# Altium project PCB_Project.PrjPcb (part 3 of 4)
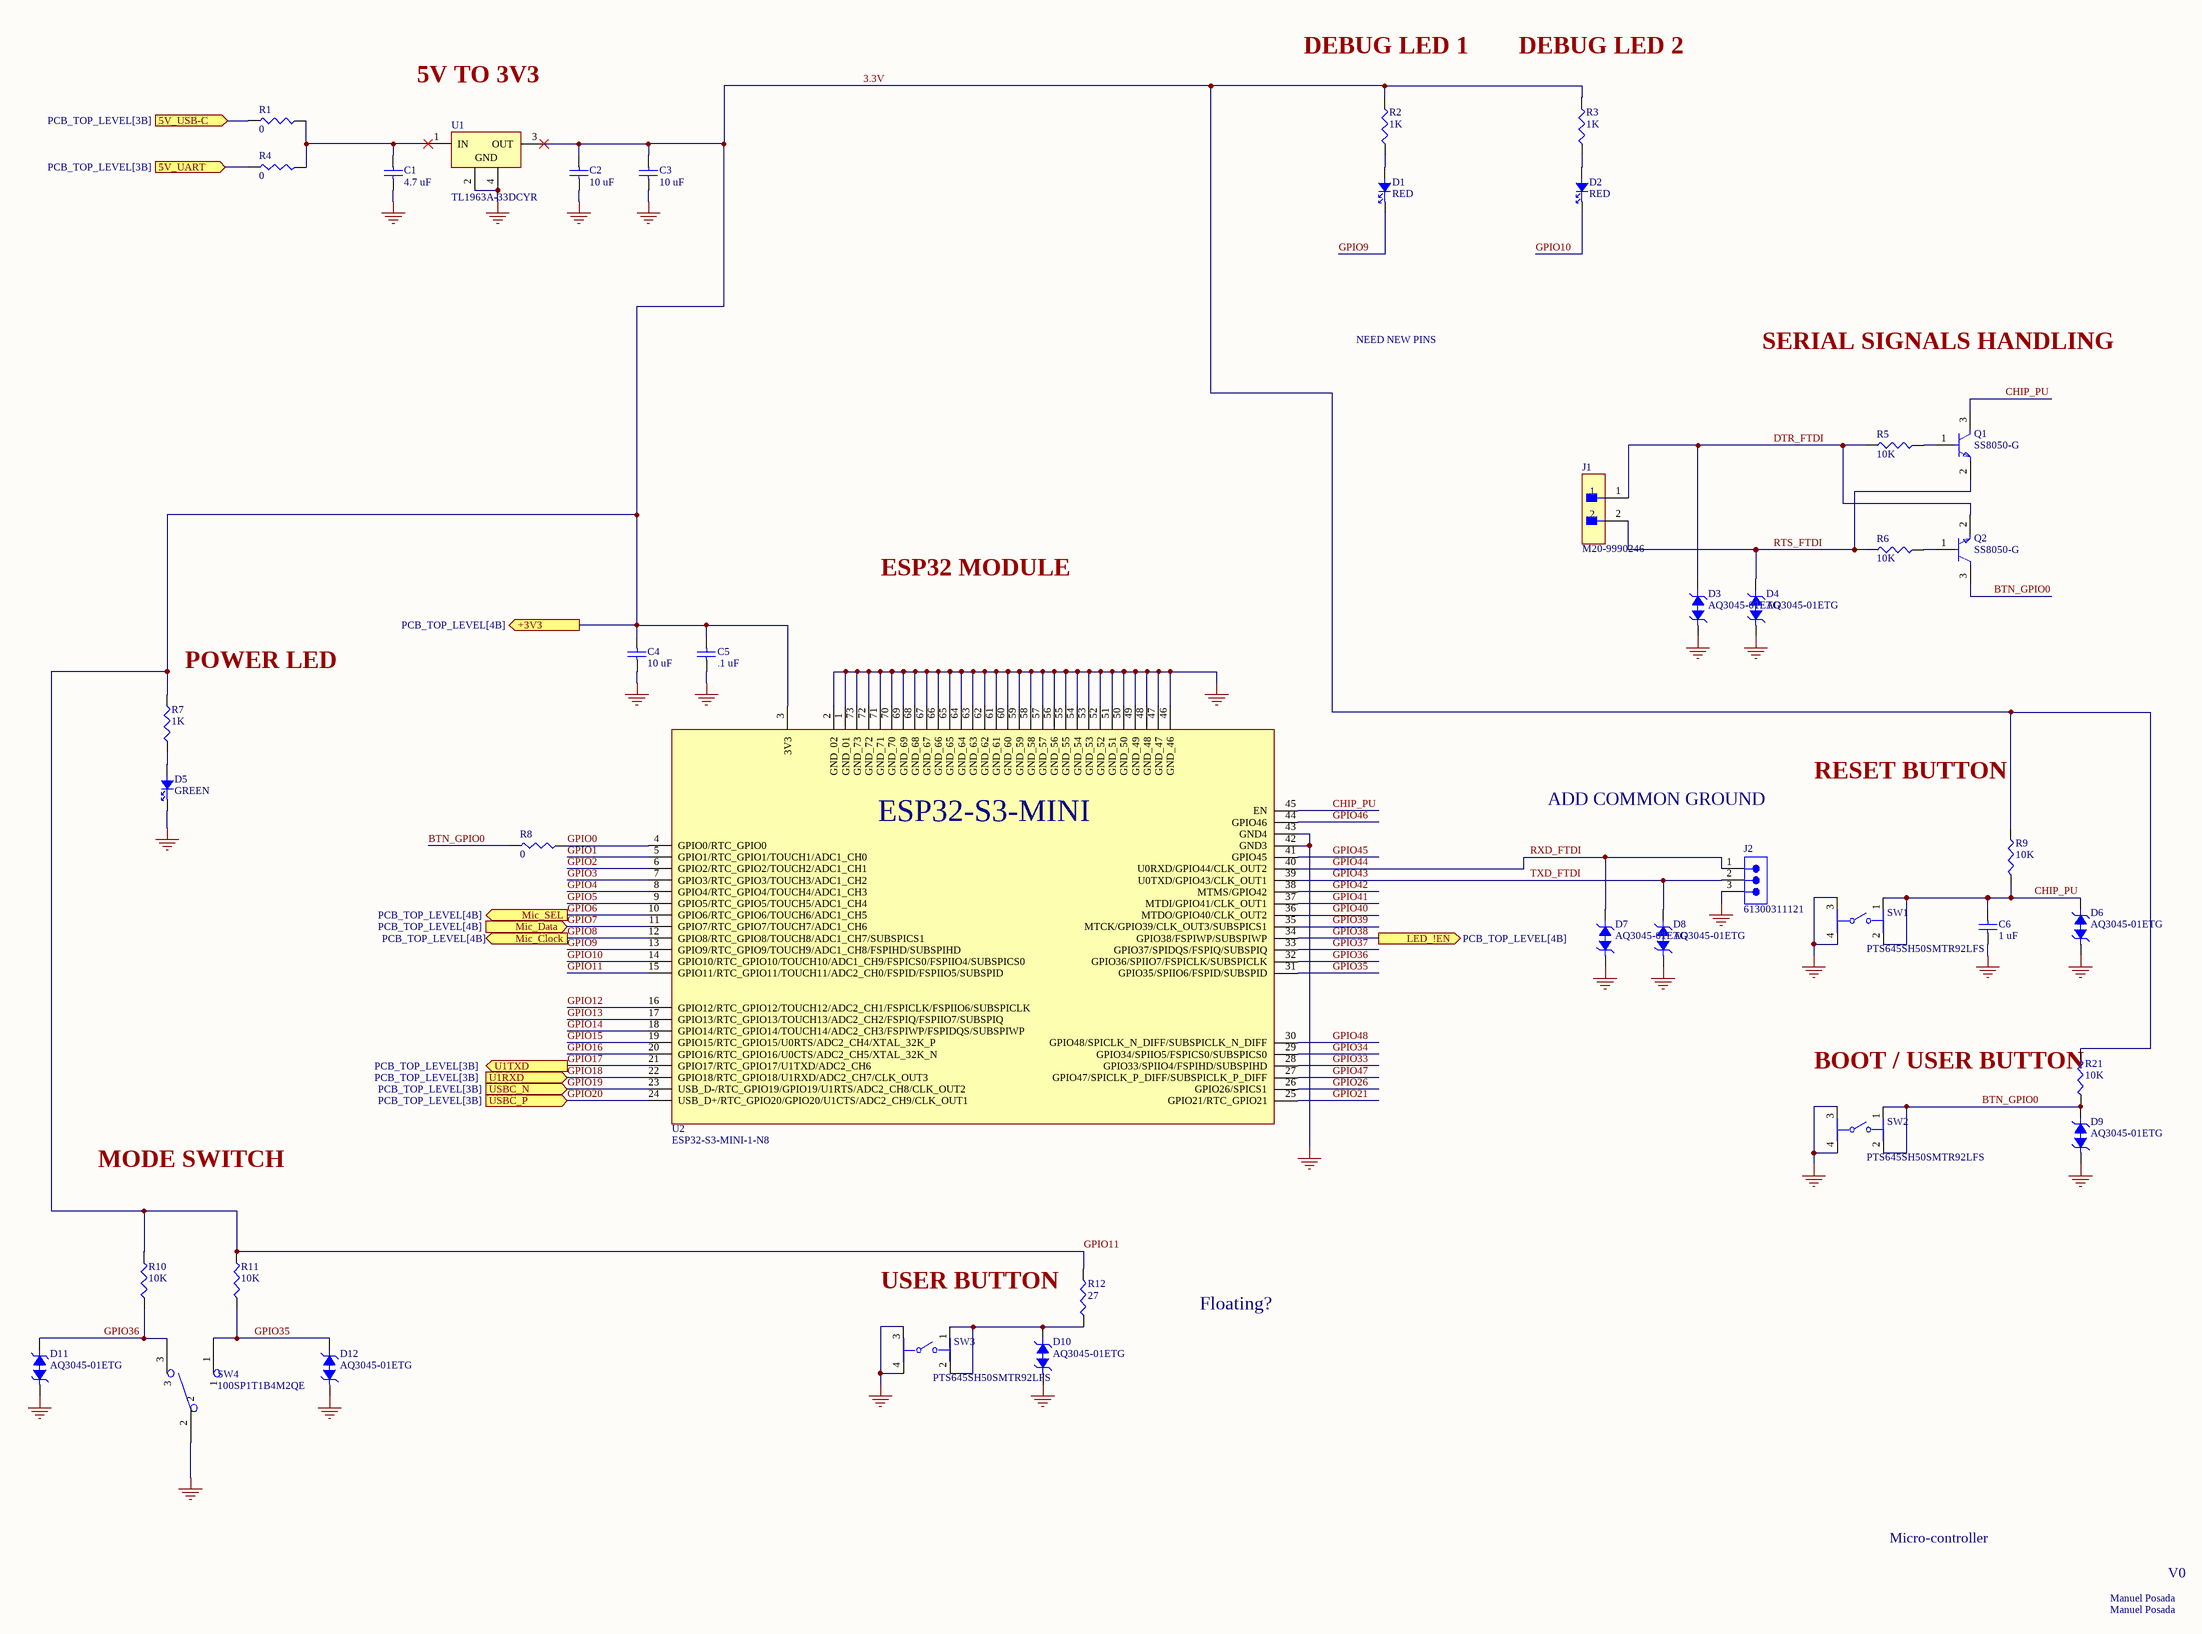
[diagram p7: Micro_controller.SchDoc]

## Sheet Micro_controller.SchDoc (continued)

### Library data of the parts (continued)
SW4 = 100SP1T1B4M2QE: Switch Toggle ON None ON SPDT Round Lever PC Pins 5A 250VAC 28VDC PC Mount; Manufacturer: E-Switch; Actuator Length: 10.414mm; Actuator Material: Brass, Chrome; Contact Voltage Rating (AC): 120V; Electrical Life: 50kcycles; Illumination Type: Illuminated, Non-Illuminated; Max Voltage Rating (DC): 28V; Number of Positions: 2; Sealable: EPOXY TERMINAL SEALED; Switch Function: On-On; Supplier: DigiKey; Supplier Part Number: EG2355-ND; Manufacturer Part Number: 100SP1T1B4M2QE; RoHS: Compliant; Category: Toggle Switches; Stock: 13324; Pricing: 1=2.63, 10=2.272, 25=2.1428, 50=2.05, 108=1.9513, 324=1.81836, 540=1.75957, 1080=1.68271 (USD); Contact Current Rating: 5A; Contact Plating: Silver; Country of Origin: Mainland China; Current Rating: 5A; Export Control Classification Number (ECCN) Code: EAR99; Height: 8.89mm; Harmonized Tariff Schedule (HTS) Code: 8536.50.70.00; Introduction Date: 2011-01-05; Lead Free: Lead Free; Length: 12.7mm; Lifecycle Status: Production; Max Current Rating: 5A; Max Operating Temperature: 85°C; Min Operating Temperature: -30°C; Mounting Technology: Through Hole; Orientation: Vertical; REACH SVHC: Yes; Termination: PC Pin; Throw Configuration: SPDT; Voltage Rating (AC): 120V; Voltage Rating (DC): 28V; ComponentLink1URL: https://datasheet.octopart.com:443/100SP1T1B4M2QE-E-Switch-datasheet-17722722.pdf?src-supplier=IHS; ComponentLink1Description: https://datasheet.octopart.com:443/100SP1T1B4M2QE-E-Switch-datasheet-17722722.pdf?src-supplier=IHS; ComponentLink2URL: https://datasheet.octopart.com:443/100SP1T1B4M2QE-E-Switch-datasheet-112052116.pdf?src-supplier=Farnell; ComponentLink2Description: https://datasheet.octopart.com:443/100SP1T1B4M2QE-E-Switch-datasheet-112052116.pdf?src-supplier=Farnell; ComponentLink3URL: https://datasheet.octopart.com:443/100SP1T1B4M2QE-E-Switch-datasheet-178529814.pdf?src-supplier=Future+Electronics; ComponentLink3Description: https://datasheet.octopart.com:443/100SP1T1B4M2QE-E-Switch-datasheet-178529814.pdf?src-supplier=Future+Electronics; ComponentLink4URL: https://datasheet.octopart.com:443/100SP1T1B4M2QE-E-Switch-datasheet-41351065.pdf?src-supplier=element14+APAC; ComponentLink4Description: https://datasheet.octopart.com:443/100SP1T1B4M2QE-E-Switch-datasheet-41351065.pdf?src-supplier=element14+APAC; ComponentLink5URL: https://datasheet.octopart.com:443/100SP1T1B4M2QE-E-Switch-datasheet-501321.pdf?src-supplier=Newark; ComponentLink5Description: https://datasheet.octopart.com:443/100SP1T1B4M2QE-E-Switch-datasheet-501321.pdf?src-supplier=Newark
U1 = TL1963A-33DCYR: IC REG LINEAR 3.3V 1.5A SOT223-4; Manufacturer: Texas Instruments; Package Body Material: Plastic; Adjustability: FIXED; Dropout Voltage1-Max: 550mV; Dropout Voltage1-Nom: 340mV; Input Voltage Absolute-Max: 20V; Min Input Voltage: 3.8V; Line Regulation-Max: 0.01%; Load Regulation-Max: 0.07%; Channels: 1; Output Voltage1-Max: 3.4V; Output Voltage1-Min: 3.2V; Regulator Type: FIXED POSITIVE SINGLE OUTPUT LDO REGULATOR; Voltage Tolerance-Max: 3%; Qualification Status: Not Qualified; Supplier: Digikey; Supplier Part Number: 296-24897-1-ND; Manufacturer Part Number: TL1963A-33DCYR; RoHS: Yes; Category: Voltage Regulators - Linear; Stock: 4105; Pricing: 1=2.91, 10=2.614, 25=2.4712, 100=2.1417, 250=2.03188, 500=1.8232, 1000=1.53764 (USD); Case/Package: SOP; Pins: 4; Package Shape: Rectangular; Terminal Finish: Tin; JESD-609 Code: e3; Max Supply Voltage: 20V; JESD-30 Code: R-PDSO-G4; Moisture Sensitivity Level: 2; Number of Outputs: 1; Operating Temperature, TJ-Max: 125°C; Operating Temperature, TJ-Min: -40°C; Output Current1-Max: 1.5A; Output Voltage1-Nom: 3.3V; Package Style: SMALL OUTLINEMeter; Packaging: Tape and Reel; Peak Reflow Temperature (Cel): 260°C; Surface Mount: Yes; Technology: BIPOLAR; Terminal Form: Gull Wing; Terminal Position: DUAL; Length: 6.5mm; Width: 3.5mm; Height - Seated (Max): 1.8mm; Terminal Pitch: 2.3mm; Reach SVHC Compliant: Yes; RoHS Compliant: Yes; ComponentLink1URL: https://www.ti.com:443/lit/ds/symlink/tl1963a.pdf?src-supplier=IHS+Markit; ComponentLink1Description: https://www.ti.com:443/lit/ds/symlink/tl1963a.pdf?src-supplier=IHS+Markit; ComponentLink2URL: https://datasheet.ciiva.com/2046/-2046068.pdf?src-supplier=Digikey; ComponentLink2Description: https://datasheet.ciiva.com/2046/-2046068.pdf?src-supplier=Digikey; LCSC Part Number: C181262
U2 = ESP32-S3-MINI-1-N8: SMD Module, ESP32-S3FN8, 8 mb Sp; Manufacturer: Espressif Systems; Supplier: Digikey; Supplier Part Number: 1965-ESP32-S3-MINI-1-N8CT-ND; Manufacturer Part Number: ESP32-S3-MINI-1-N8; RoHS: No; Category: LDO; Stock: 2024; Pricing: 1=3.1 (USD); LCSC Part Number: C2913206

## Sheet USB-C_to_ESP.SchDoc
size B; SheetNumber: 2; SheetTotal: 6
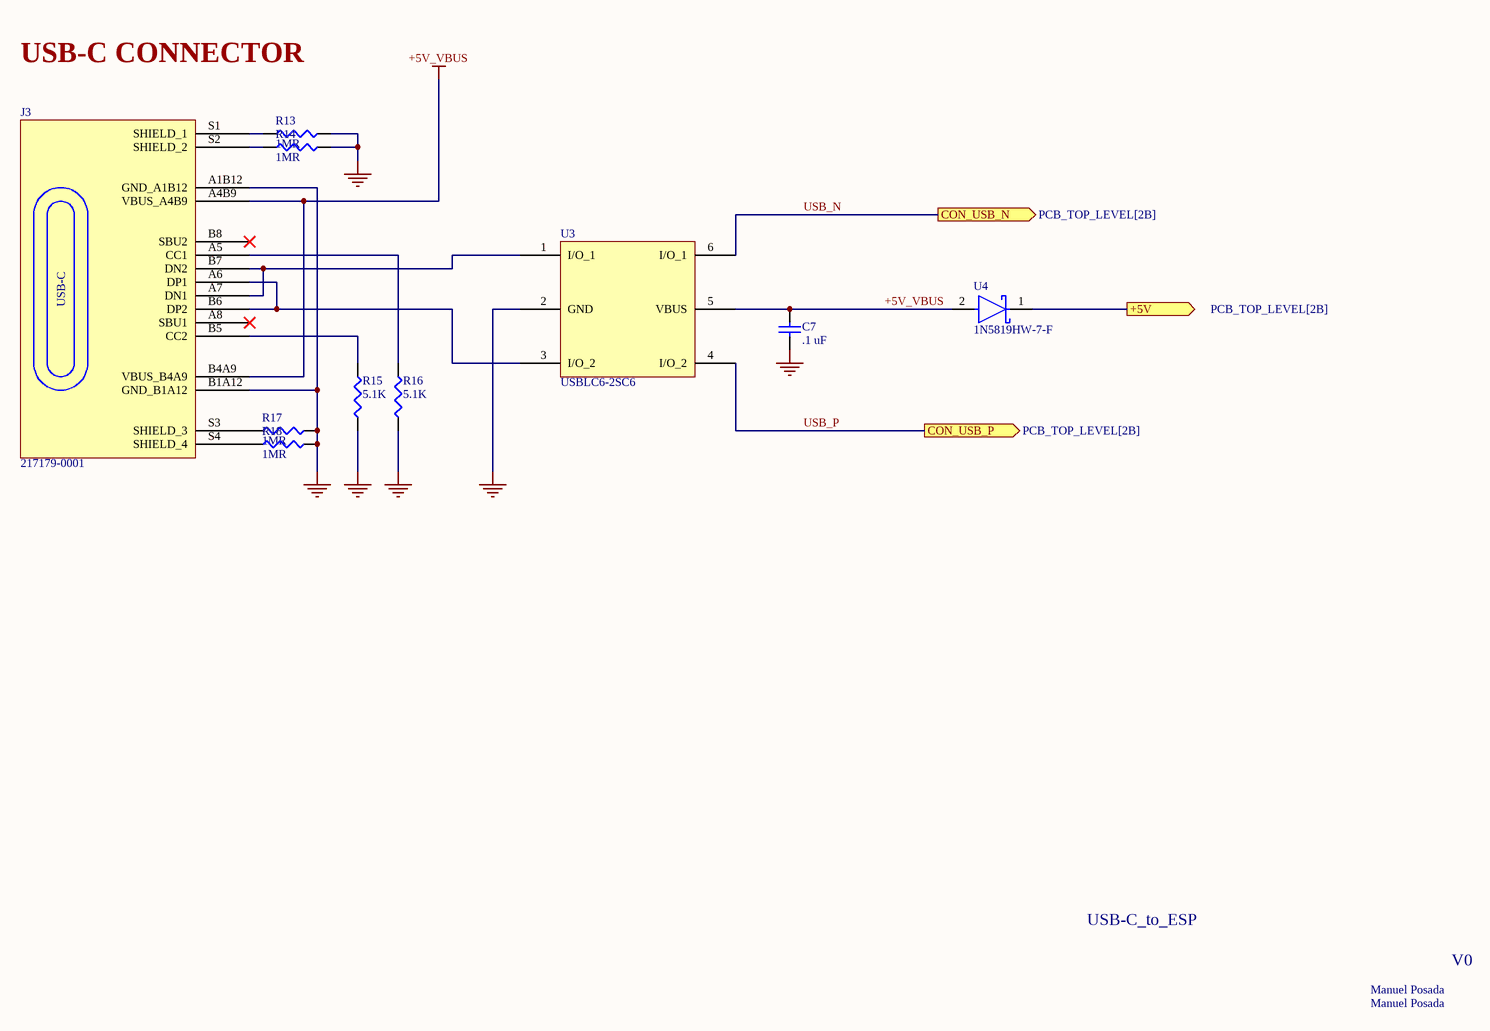
[diagram p2: USB-C_to_ESP.SchDoc]

### Parts
C7  .1 uF  [CAP_CL21_SAM-L]
J3  217179-0001  [FP-2171790001-MFG]
R13  1MR  [RES_1220_SUS-L]
R14  1MR  [RES_1220_SUS-L]
R15  5.1K  [RES_1220_SUS-L]
R16  5.1K  [RES_1220_SUS-L]
R17  1MR  [RES_1220_SUS-L]
R18  1MR  [RES_1220_SUS-L]
U3  USBLC6-2SC6  [SOT23-6L_STM]
U4  1N5819HW-7-F  [FP-SOD123-IPC_B]

### Ports
+5V (out, see PCB_TOP_LEVEL[2B]), CON_USB_N (out, see PCB_TOP_LEVEL[2B]), CON_USB_P (out, see PCB_TOP_LEVEL[2B])

### Nets
+5V_VBUS: C7.2 J3.A4B9(VBUS_A4B9) J3.B4A9(VBUS_B4A9) U3.5(VBUS) U4.2(A)
GND: C7.1 J3.A1B12(GND_A1B12) J3.B1A12(GND_B1A12) R13.2 R14.2 R15.1 R16.1 R17.2 R18.2 U3.2(GND)
USB_N: U3.6(I/O_1) ; port CON_USB_N  [project net GPIO19]
USB_P: U3.4(I/O_2) ; port CON_USB_P  [project net GPIO20]
NetJ3_A5: J3.A5(CC1) R16.2
NetJ3_A6: J3.A6(DP1) J3.B6(DP2) U3.3(I/O_2)
NetJ3_A7: J3.A7(DN1) J3.B7(DN2) U3.1(I/O_1)
NetJ3_B5: J3.B5(CC2) R15.2
NetJ3_S1: J3.S1(SHIELD_1) R13.1
NetJ3_S2: J3.S2(SHIELD_2) R14.1
NetJ3_S3: J3.S3(SHIELD_3) R17.1
NetJ3_S4: J3.S4(SHIELD_4) R18.1
NetR1_1: U4.1(C) ; port +5V

Not connected (* = marked no-connect by the designer): J3 A8(SBU1)* B8(SBU2)*

### Notes on the sheet
- USB-C CONNECTOR
- USB-C_to_ESP
- Manuel Posada
- V0
- (in symbol 217179-0001) USB-C

### Library data of the parts
C7 = CL21B104KBCNNNC: 50V 100nF X7R ±10% 0805 Multilayer Ceramic Capacitors MLCC - SMD/SMT ROHS; Manufacturer: Samsung Electro-Mechanics; Supplier: DigiKey; Supplier Part Number: 1276-1003-6-ND; Manufacturer Part Number: CL21B104KBCNNNC; RoHS: Compliant; Category: Ceramic Capacitors; Stock: 2859375; Pricing: 1=0.08, 10=0.006 (USD); Value: 100nF; Case/Package: 0805; Case Code (Imperial): 0805; Case Code (Metric): 2012; China RoHS: Compliant; Contact Plating: Tin; Country of Origin: Mainland China, Philippines, South Korea; Depth: 1.25mm; Dielectric: X7R; Dielectric Material: Ceramic; Export Control Classification Number (ECCN) Code: EAR99; Height: 950µm; Harmonized Tariff Schedule (HTS) Code: 8532.24.00.20; Introduction Date: 2009-07-27; Lead Free: Lead Free; Length: 2mm; Lifecycle Status: Production; Material: Ceramic; Max Operating Temperature: 125°C; Min Operating Temperature: -55°C; Mounting Technology: Surface Mount; Number of Terminals: 2; Radiation Hardening: No; REACH SVHC: Yes; Schedule B: 8532240020, 8532240020|8532240020, 8532240020|8532240020|8532240020, 8532240020|8532240020|8532240020|8532240020; Thickness: 939.8µm; Tolerance: 10%; Voltage: 50V; Voltage Rating: 50V; Voltage Rating (DC): 50V; Width: 1.25mm; ComponentLink1URL: https://datasheet.octopart.com:443/CL21B104KBCNNNC-Samsung-Electro-Mechanics-datasheet-137745078.pdf?src-supplier=IHS; ComponentLink1Description: https://datasheet.octopart.com:443/CL21B104KBCNNNC-Samsung-Electro-Mechanics-datasheet-137745078.pdf?src-supplier=IHS; ComponentLink2URL: https://datasheet.octopart.com/CL21B104KBCNNNC-Samsung-Electro-Mechanics-datasheet-8324245.pdf; ComponentLink2Description: https://datasheet.octopart.com/CL21B104KBCNNNC-Samsung-Electro-Mechanics-datasheet-8324245.pdf; ComponentLink3URL: https://datasheet.octopart.com/CL21B104KBCNNNC-Samsung-Electro-Mechanics-datasheet-97040617.pdf; ComponentLink3Description: https://datasheet.octopart.com/CL21B104KBCNNNC-Samsung-Electro-Mechanics-datasheet-97040617.pdf; ComponentLink4URL: https://datasheet.octopart.com:443/CL21B104KBCNNNC-Samsung-Electro-Mechanics-datasheet-11548950.pdf?src-supplier=Future+Electronics; ComponentLink4Description: https://datasheet.octopart.com:443/CL21B104KBCNNNC-Samsung-Electro-Mechanics-datasheet-11548950.pdf?src-supplier=Future+Electronics; ComponentLink5URL: https://datasheet.octopart.com:443/CL21B104KBCNNNC-Samsung-Electro-Mechanics-datasheet-116891032.pdf?src-supplier=Future+Electronics; ComponentLink5Description: https://datasheet.octopart.com:443/CL21B104KBCNNNC-Samsung-Electro-Mechanics-datasheet-116891032.pdf?src-supplier=Future+Electronics; ComponentLink6URL: https://datasheet.octopart.com:443/CL21B104KBCNNNC-Samsung-Electro-Mechanics-datasheet-81462175.pdf?src-supplier=Future+Electronics; ComponentLink6Description: https://datasheet.octopart.com:443/CL21B104KBCNNNC-Samsung-Electro-Mechanics-datasheet-81462175.pdf?src-supplier=Future+Electronics; ComponentLink7URL: https://datasheet.octopart.com:443/CL21B104KBCNNNC-Samsung-datasheet-42485244.pdf?src-supplier=Future+Electronics; ComponentLink7Description: https://datasheet.octopart.com:443/CL21B104KBCNNNC-Samsung-datasheet-42485244.pdf?src-supplier=Future+Electronics; ComponentLink8URL: https://datasheet.octopart.com:443/CL21B104KBCNNNC-Samsung-Electro-Mechanics-datasheet-149045937.pdf?src-supplier=Future+Electronics; ComponentLink8Description: https://datasheet.octopart.com:443/CL21B104KBCNNNC-Samsung-Electro-Mechanics-datasheet-149045937.pdf?src-supplier=Future+Electronics; ComponentLink9URL: https://datasheet.octopart.com:443/CL21B104KBCNNNC-Samsung-datasheet-8326407.pdf?src-supplier=TME; ComponentLink9Description: https://datasheet.octopart.com:443/CL21B104KBCNNNC-Samsung-datasheet-8326407.pdf?src-supplier=TME
J3 = 217179-0001: CONN RCP USB2.0 TYP C 24P SMD RA; Manufacturer: Molex; Supplier: Digikey; Supplier Part Number: 900-2171790001CT-ND; Manufacturer Part Number: 217179-0001; RoHS: No; Category: Connectors; Stock: 7228; Pricing: 1=0.9, 10=0.745, 100=0.6212 (USD); LCSC Part Number: C3197684
R13 R14 R17 R18 = RG2012P-105-B-T5: Res Thin Film 0805 1M Ohm 0.1% 0.125W(1/8W) ±25ppm/C Sulfur Resistant Pad SMD Automotive T/R; Manufacturer: Susumu; Power Dissipation: 125mW; Value: 1MΩ; Temperature Coefficient: 25ppm/°C; Voltage Rating: 150V; Supplier: DigiKey; Supplier Part Number: 408-RG2012P-105-B-T5CT-ND; Manufacturer Part Number: RG2012P-105-B-T5; RoHS: Compliant; Category: Chip SMD Resistors; Stock: 192478; Pricing: 1=0.1, 10=0.077, 25=0.0712, 50=0.0672, 100=0.0635, 250=0.05896, 500=0.0558, 1000=0.0529 (USD); Case/Package: 0805; Case Code (Imperial): 0805; Case Code (Metric): 2012; Composition: Thin Film; Country of Origin: Mainland China, Japan; Export Control Classification Number (ECCN) Code: EAR99; Height: 400µm; Harmonized Tariff Schedule (HTS) Code: 8533.21.00.30; Introduction Date: 2006-03-30; Lead Free: Lead Free; Length: 2mm; Lifecycle Status: Production; Max Operating Temperature: 155°C; Min Operating Temperature: -55°C; Mounting Technology: Surface Mount; Number of Terminals: 2; Power Rating: 125mW; REACH SVHC: Yes; Termination: SMD/SMT; Tolerance: 0.1%; Voltage Rating (DC): 150V; Width: 1.25mm; Working Voltage: 150V; ComponentLink1URL: https://datasheet.octopart.com:443/RG2012P-105-B-T5-Susumu-datasheet-182148308.pdf?src-supplier=IHS; ComponentLink1Description: https://datasheet.octopart.com:443/RG2012P-105-B-T5-Susumu-datasheet-182148308.pdf?src-supplier=IHS; ComponentLink2URL: https://datasheet.octopart.com:443/RG2012P-105-B-T5-Susumu-datasheet-104167497.pdf?src-supplier=Upverter; ComponentLink2Description: https://datasheet.octopart.com:443/RG2012P-105-B-T5-Susumu-datasheet-104167497.pdf?src-supplier=Upverter; ComponentLink3URL: https://datasheet.octopart.com:443/RG2012P-105-B-T5-Susumu-datasheet-68296037.pdf?src-supplier=Future+Electronics; ComponentLink3Description: https://datasheet.octopart.com:443/RG2012P-105-B-T5-Susumu-datasheet-68296037.pdf?src-supplier=Future+Electronics; ComponentLink4URL: https://datasheet.octopart.com:443/RG2012P-105-B-T5-Susumu-datasheet-12510050.pdf?src-supplier=Future+Electronics; ComponentLink4Description: https://datasheet.octopart.com:443/RG2012P-105-B-T5-Susumu-datasheet-12510050.pdf?src-supplier=Future+Electronics; ComponentLink5URL: https://datasheet.octopart.com/RG2012P-105-B-T5-Susumu-datasheet-12509734.pdf; ComponentLink5Description: https://datasheet.octopart.com/RG2012P-105-B-T5-Susumu-datasheet-12509734.pdf
R15 R16 = RG2012P-512-B-T5: Res Thin Film 0805 5.1K Ohm 0.1% 0.125W(1/8W) ±25ppm/C Sulfur Resistant Pad SMD Automotive T/R; Manufacturer: Susumu; Max Power Dissipation: 125mW; Value: 5.1kΩ; Temperature Coefficient: 25ppm/°C; Voltage Rating: 150V; Supplier: DigiKey; Supplier Part Number: RG20P5.1KBDKR-ND; Manufacturer Part Number: RG2012P-512-B-T5; RoHS: Compliant; Category: Chip SMD Resistors; Stock: 18763; Pricing: 1=0.12, 10=0.1, 25=0.0928, 50=0.0876, 100=0.0828, 250=0.07684, 500=0.07274, 1000=0.06901 (USD); Case/Package: 0805; Case Code (Imperial): 0805; Case Code (Metric): 2012; Composition: Thin Film; Features: Automotive AEC-Q200; Height: 400µm; Lead Free: Lead Free; Length: 2.0066mm; Lifecycle Status: Production; Max Operating Temperature: 155°C; Min Operating Temperature: -55°C; Mounting Technology: Surface Mount; Number of Terminals: 2; Number of Terminations: 2; Power Dissipation: 125mW; Power Rating: 125mW; REACH SVHC: Yes; Schedule B: 8533210045, 8533210045|8533210045|8533210045|8533210045|8533210045; Termination: SMD/SMT; Tolerance: 0.1%; Voltage Rating (DC): 150V; Width: 1.25mm; Working Voltage: 150V; ComponentLink1URL: https://datasheet.octopart.com:443/RG2012P-512-B-T5-Susumu-datasheet-182148308.pdf?src-supplier=IHS; ComponentLink1Description: https://datasheet.octopart.com:443/RG2012P-512-B-T5-Susumu-datasheet-182148308.pdf?src-supplier=IHS; ComponentLink2URL: https://datasheet.octopart.com:443/RG2012P-512-B-T5-Susumu-datasheet-104167497.pdf?src-supplier=Upverter; ComponentLink2Description: https://datasheet.octopart.com:443/RG2012P-512-B-T5-Susumu-datasheet-104167497.pdf?src-supplier=Upverter; ComponentLink3URL: https://datasheet.octopart.com:443/RG2012P-512-B-T5-Susumu-datasheet-12510102.pdf?src-supplier=Future+Electronics; ComponentLink3Description: https://datasheet.octopart.com:443/RG2012P-512-B-T5-Susumu-datasheet-12510102.pdf?src-supplier=Future+Electronics; ComponentLink4URL: https://datasheet.octopart.com:443/RG2012P-512-B-T5-Susumu-datasheet-12510050.pdf?src-supplier=Future+Electronics; ComponentLink4Description: https://datasheet.octopart.com:443/RG2012P-512-B-T5-Susumu-datasheet-12510050.pdf?src-supplier=Future+Electronics; ComponentLink5URL: https://datasheet.octopart.com/RG2012P-512-B-T5-Susumu-datasheet-12509734.pdf; ComponentLink5Description: https://datasheet.octopart.com/RG2012P-512-B-T5-Susumu-datasheet-12509734.pdf; ComponentLink6URL: https://datasheet.octopart.com:443/RG2012P-512-B-T5-Susumu-datasheet-118552.pdf?src-supplier=DigiKey; ComponentLink6Description: https://datasheet.octopart.com:443/RG2012P-512-B-T5-Susumu-datasheet-118552.pdf?src-supplier=DigiKey
U3 = USBLC6-2SC6: 17V Clamp 5A (8/20µs) Ipp Tvs Diode Surface Mount SOT-23-6; Manufacturer: STMicroelectronics; Breakdown Voltage: 6V; Value: 2.5pF; Data Rate: 480Mbps; Direction: Unidirectional; Element Configuration: Dual; ESD Protection: Yes; Forward Voltage: 1.1V; Leakage Current: 150nA; Max Junction Temperature (Tj): 125°C; Max Repetitive Reverse Voltage (Vrrm): 5.25V; Number of Bidirectional Channels: 2; Number of Elements: 1; Reverse Standoff Voltage: 5V; Test Current: 1mA; Supplier: DigiKey; Supplier Part Number: 497-5235-1-ND; Manufacturer Part Number: USBLC6-2SC6; RoHS: Compliant; Category: TVS Diodes; Stock: 229189; Pricing: 1=0.36, 10=0.243, 100=0.163, 500=0.127, 1000=0.114, 3000=0.077, 6000=0.076, 9000=0.075 (USD); Case/Package: SOT-23; China RoHS: Compliant; Clamping Voltage: 17V; Contact Plating: Tin; Country of Origin: Mainland China; Depth: 1.75mm; Export Control Classification Number (ECCN) Code: EAR99; Height: 1.45mm; Harmonized Tariff Schedule (HTS) Code: 8541.10.00.50; Introduction Date: 2005-03-15; Lead Free: Lead Free; Length: 3.05mm; Lifecycle Status: Production; Max Breakdown Voltage: 6V; Max Operating Temperature: 125°C; Max Reverse Leakage Current: 150nA; Min Breakdown Voltage: 6V; Min Operating Temperature: -40°C; Mounting Technology: Surface Mount; Number of Channels: 2; Pins: 6; Number of Terminals: 6; Operating Supply Voltage: 1.1V; Peak Pulse Current: 5A; Peak Reverse Current: 150nA; Polarity: Unidirectional; Power Line Protection: Yes; Radiation Hardening: No; REACH SVHC: Yes; Reverse Breakdown Voltage: 6V; Schedule B: 8536300000, 8536300000|8536300000|8536300000|8536300000|8536300000|8536300000|8536300000|8536300000|8536300000|8536300000|8536300000|8536300000|8536300000|8536300000|8536300000|8536300000|8536300000|8536300000|8536300000|8536300000|8536300000|8536300000|8536300000|85; Termination: SMD/SMT; Width: 1.75mm; Working Voltage: 5V; ComponentLink1URL: https://datasheet.octopart.com:443/USBLC6-2SC6-STMicroelectronics-datasheet-10412581.pdf?src-supplier=Newark; ComponentLink1Description: https://datasheet.octopart.com:443/USBLC6-2SC6-STMicroelectronics-datasheet-10412581.pdf?src-supplier=Newark; ComponentLink2URL: https://datasheet.octopart.com:443/USBLC6-2SC6-STMicroelectronics-datasheet-181961833.pdf?src-supplier=Newark; ComponentLink2Description: https://datasheet.octopart.com:443/USBLC6-2SC6-STMicroelectronics-datasheet-181961833.pdf?src-supplier=Newark; ComponentLink3URL: https://datasheet.octopart.com:443/USBLC6-2SC6-STMicroelectronics-datasheet-525477.pdf?src-supplier=Factory+Futures; ComponentLink3Description: https://datasheet.octopart.com:443/USBLC6-2SC6-STMicroelectronics-datasheet-525477.pdf?src-supplier=Factory+Futures; ComponentLink4URL: https://datasheet.octopart.com:443/USBLC6-2SC6-STMicroelectronics-datasheet-82998616.pdf?src-supplier=Farnell; ComponentLink4Description: https://datasheet.octopart.com:443/USBLC6-2SC6-STMicroelectronics-datasheet-82998616.pdf?src-supplier=Farnell; ComponentLink5URL: https://datasheet.octopart.com:443/USBLC6-2SC6-STMicroelectronics-datasheet-46285.pdf?src-supplier=Farnell; ComponentLink5Description: https://datasheet.octopart.com:443/USBLC6-2SC6-STMicroelectronics-datasheet-46285.pdf?src-supplier=Farnell; ComponentLink6URL: https://datasheet.octopart.com:443/USBLC6-2SC6-STMicroelectronics-datasheet-14050643.pdf?src-supplier=iiiC; ComponentLink6Description: https://datasheet.octopart.com:443/USBLC6-2SC6-STMicroelectronics-datasheet-14050643.pdf?src-supplier=iiiC; ComponentLink7URL: https://datasheet.octopart.com:443/USBLC6-2SC6-STMicroelectronics-datasheet-10521292.pdf?src-supplier=Jameco; ComponentLink7Description: https://datasheet.octopart.com:443/USBLC6-2SC6-STMicroelectronics-datasheet-10521292.pdf?src-supplier=Jameco
U4 = 1N5819HW-7-F: DIODE SCHOTTKY 40V 1A SOD123; Manufacturer: Diodes Inc.; Value: 50pF; Element Configuration: Single; Forward Voltage: 750mV; Max Forward Surge Current (Ifsm): 25A; Max Junction Temperature (Tj): 125°C; Max Power Dissipation: 450mW; Number of Elements: 1; Peak Reverse Current: 1mA; Polarity: Standard; Supplier: DigiKey; Supplier Part Number: 1N5819HW-FDICT-ND; Manufacturer Part Number: 1N5819HW-7-F; RoHS: Compliant; Category: Schottky Diodes; Stock: 184558; Pricing: 1=0.29, 10=0.166, 100=0.1036, 500=0.07624, 1000=0.06736, 3000=0.0505, 6000=0.044, 9000=0.03923, 15000=0.039, 21000=0.03886, 30000=0.03872, 75000=0.03561, 150000=0.0323 (USD); Average Rectified Current: 1A; Case/Package: SOD-123-2; China RoHS: Compliant; Contact Plating: Tin; Current Rating: 1A; Forward Current: 1A; Height: 1.45mm; Lead Free: Lead Free; Length: 2.85mm; Lifecycle Status: Production; Max Operating Temperature: 125°C; Max Output current: 1A; Max Repetitive Reverse Voltage (Vrrm): 40V; Max Reverse Voltage (DC): 40V; Min Breakdown Voltage: 40V; Min Operating Temperature: -65°C; Pins: 2; Number of Terminals: 2; Output Current: 1A; Packaging: Tape and Reel; Peak Non-Repetitive Surge Current: 25A; Radiation Hardening: No; REACH SVHC: Yes; Reverse Standoff Voltage: 40V; Reverse Voltage: 40V; Schedule B: 8541100080, 8541100080|8541100080|8541100080|8541100080|8541100080; Termination: SMD/SMT; Voltage Rating (DC): 40V; Weight: 10.007382mg; Width: 1.7mm; ComponentLink1URL: https://datasheet.octopart.com:443/1N5819HW-7-F-Diodes-Inc.-datasheet-180549196.pdf?src-supplier=IHS; ComponentLink1Description: https://datasheet.octopart.com:443/1N5819HW-7-F-Diodes-Inc.-datasheet-180549196.pdf?src-supplier=IHS; ComponentLink2URL: https://datasheet.octopart.com:443/1N5819HW-7-F-Diodes-Inc.-datasheet-8332965.pdf?src-supplier=Upverter; ComponentLink2Description: https://datasheet.octopart.com:443/1N5819HW-7-F-Diodes-Inc.-datasheet-8332965.pdf?src-supplier=Upverter; ComponentLink3URL: https://sigma.octopart.com:443/138895985/technical_drawing/Diodes-Inc.-1N5819HW-7-F.pdf?src-supplier=Upverter; ComponentLink3Description: https://sigma.octopart.com:443/138895985/technical_drawing/Diodes-Inc.-1N5819HW-7-F.pdf?src-supplier=Upverter; ComponentLink4URL: https://datasheet.octopart.com:443/1N5819HW-7-F-Diodes-Inc.-datasheet-134530231.pdf?src-supplier=Future+Electronics; ComponentLink4Description: https://datasheet.octopart.com:443/1N5819HW-7-F-Diodes-Inc.-datasheet-134530231.pdf?src-supplier=Future+Electronics; ComponentLink5URL: https://datasheet.octopart.com:443/1N5819HW-7-F-Diodes-Inc.-datasheet-34441420.pdf?src-supplier=Future+Electronics; ComponentLink5Description: https://datasheet.octopart.com:443/1N5819HW-7-F-Diodes-Inc.-datasheet-34441420.pdf?src-supplier=Future+Electronics; ComponentLink6URL: https://datasheet.octopart.com:443/1N5819HW-7-F-Diodes-Inc.-datasheet-10497210.pdf?src-supplier=Future+Electronics; ComponentLink6Description: https://datasheet.octopart.com:443/1N5819HW-7-F-Diodes-Inc.-datasheet-10497210.pdf?src-supplier=Future+Electronics; ComponentLink7URL: https://datasheet.octopart.com:443/1N5819HW-7-F-Diodes-Inc.-datasheet-169364014.pdf?src-supplier=Newark; ComponentLink7Description: https://datasheet.octopart.com:443/1N5819HW-7-F-Diodes-Inc.-datasheet-169364014.pdf?src-supplier=Newark; ComponentLink8URL: https://datasheet.octopart.com:443/1N5819HW-7-F-Diodes-Inc.-datasheet-78715396.pdf?src-supplier=Newark; ComponentLink8Description: https://datasheet.octopart.com:443/1N5819HW-7-F-Diodes-Inc.-datasheet-78715396.pdf?src-supplier=Newark; ComponentLink9URL: https://datasheet.octopart.com:443/1N5819HW-7-F-Diodes-Inc.-datasheet-14053419.pdf?src-supplier=iiiC; ComponentLink9Description: https://datasheet.octopart.com:443/1N5819HW-7-F-Diodes-Inc.-datasheet-14053419.pdf?src-supplier=iiiC; ComponentLink10URL: https://datasheet.octopart.com:443/1N5819HW-7-F-Diodes-Inc.-datasheet-7274306.pdf?src-supplier=Jameco; ComponentLink10Description: https://datasheet.octopart.com:443/1N5819HW-7-F-Diodes-Inc.-datasheet-7274306.pdf?src-supplier=Jameco; ComponentLink11URL: https://datasheet.octopart.com:443/1N5819HW-7-F-Diodes-Inc.-datasheet-16627.pdf?src-supplier=Mouser; ComponentLink11Description: https://datasheet.octopart.com:443/1N5819HW-7-F-Diodes-Inc.-datasheet-16627.pdf?src-supplier=Mouser; ComponentLink12URL: https://datasheet.octopart.com:443/1N5819HW-7-F-Diodes-Inc.-datasheet-145195.pdf?src-supplier=DigiKey; ComponentLink12Description: https://datasheet.octopart.com:443/1N5819HW-7-F-Diodes-Inc.-datasheet-145195.pdf?src-supplier=DigiKey; ComponentLink13URL: http://sigma.octopart.com:80/15616867/materials_sheet/Diodes-Inc.-1N5819HW-7-F.pdf?src-supplier=Compliance+Statements; ComponentLink13Description: http://sigma.octopart.com:80/15616867/materials_sheet/Diodes-Inc.-1N5819HW-7-F.pdf?src-supplier=Compliance+Statements

## Sheet Microphone.SchDoc
size A; SheetNumber: 6; SheetTotal: 6
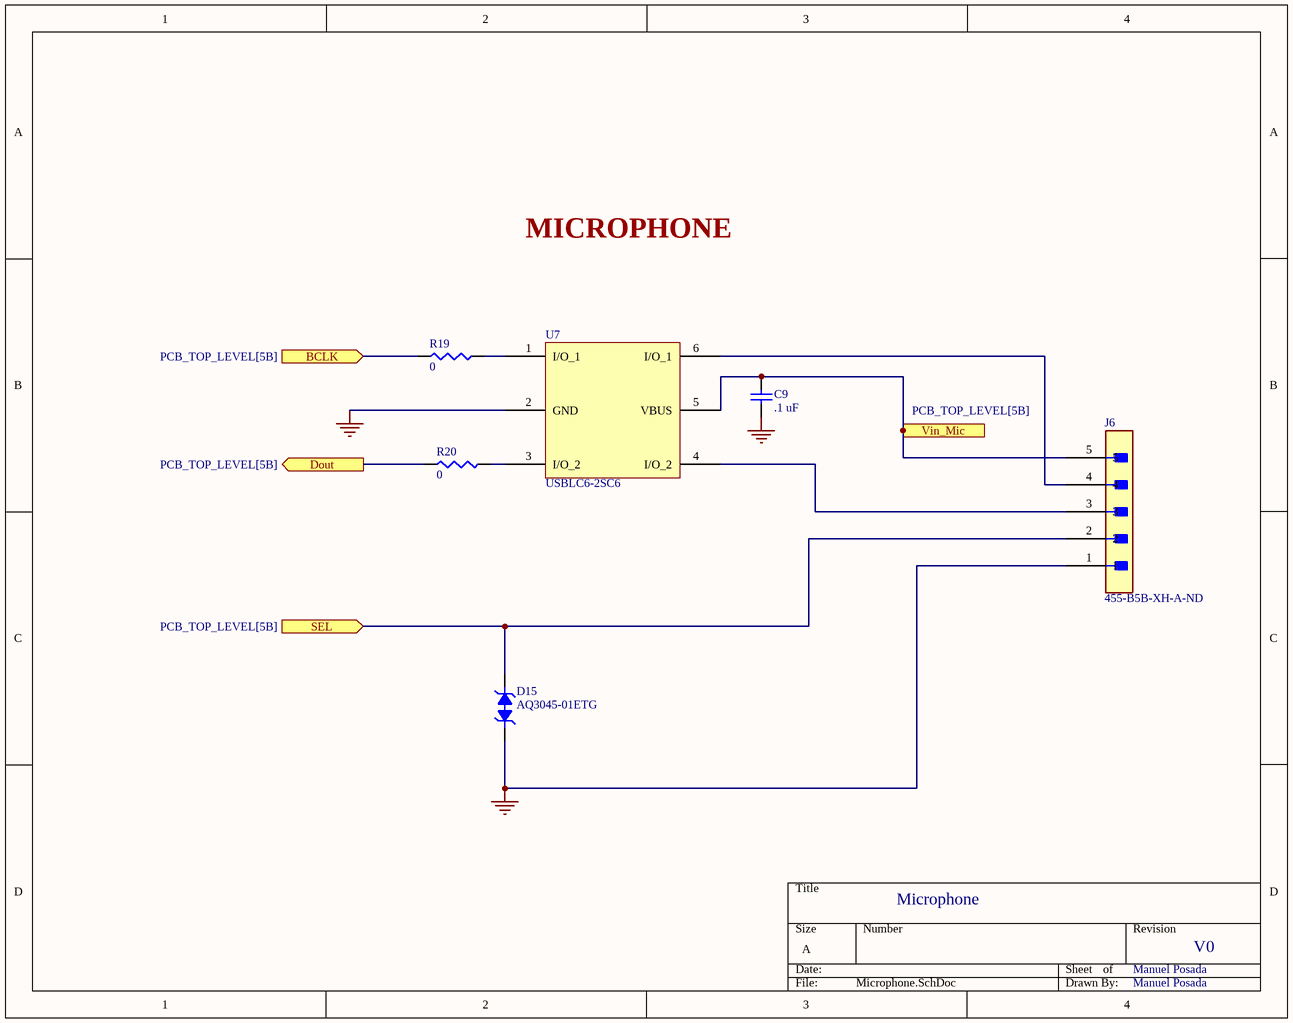
[diagram p3: Microphone.SchDoc]

### Parts
C9  .1 uF  [CAP_CL21_SAM-L]
D15  AQ3045-01ETG  [SOD882]
J6  455-B5B-XH-A-ND  [CONN_B5B-XH-A_JST]
R19  0  [RES_1220_SUS-L]
R20  0  [RES_1220_SUS-L]
U7  USBLC6-2SC6  [SOT23-6L_STM]

### Ports
BCLK (in, see PCB_TOP_LEVEL[5B]), Dout (out, see PCB_TOP_LEVEL[5B]), SEL (in, see PCB_TOP_LEVEL[5B]), Vin_Mic (in, see PCB_TOP_LEVEL[5B])

### Nets
GND: C9.1 D15.1 J6.1 U7.2(GND)
3.3V: C9.2 J6.5 U7.5(VBUS) ; port Vin_Mic
GPIO6: D15.2 J6.2 ; port SEL
GPIO7: R20.1 ; port Dout
GPIO8: R19.1 ; port BCLK
NetJ6_3: J6.3 U7.4(I/O_2)
NetJ6_4: J6.4 U7.6(I/O_1)
NetR19_2: R19.2 U7.1(I/O_1)
NetR20_2: R20.2 U7.3(I/O_2)

### Notes on the sheet
- MICROPHONE
- Microphone
- Manuel Posada
- V0

### Library data of the parts
C9 = CL21B104KBCNNNC: as C7 on sheet USB-C_to_ESP; Supplier: DigiKey; Supplier Part Number: 1276-1003-6-ND; Manufacturer Part Number: CL21B104KBCNNNC; RoHS: Compliant; Category: Ceramic Capacitors; Stock: 2859375; Pricing: 1=0.08, 10=0.006 (USD); Value: 100nF; Case/Package: 0805; Case Code (Imperial): 0805; Case Code (Metric): 2012; China RoHS: Compliant; Contact Plating: Tin; Country of Origin: Mainland China, Philippines, South Korea; Depth: 1.25mm; Dielectric: X7R; Dielectric Material: Ceramic; Export Control Classification Number (ECCN) Code: EAR99; Height: 950µm; Harmonized Tariff Schedule (HTS) Code: 8532.24.00.20; Introduction Date: 2009-07-27; Lead Free: Lead Free; Length: 2mm; Lifecycle Status: Production; Material: Ceramic; Max Operating Temperature: 125°C; Min Operating Temperature: -55°C; Mounting Technology: Surface Mount; Number of Terminals: 2; Radiation Hardening: No; REACH SVHC: Yes; Schedule B: 8532240020, 8532240020|8532240020, 8532240020|8532240020|8532240020, 8532240020|8532240020|8532240020|8532240020; Thickness: 939.8µm; Tolerance: 10%; Voltage: 50V; Voltage Rating: 50V; Voltage Rating (DC): 50V; Width: 1.25mm; ComponentLink1URL: https://datasheet.octopart.com:443/CL21B104KBCNNNC-Samsung-Electro-Mechanics-datasheet-137745078.pdf?src-supplier=IHS; ComponentLink1Description: https://datasheet.octopart.com:443/CL21B104KBCNNNC-Samsung-Electro-Mechanics-datasheet-137745078.pdf?src-supplier=IHS; ComponentLink2URL: https://datasheet.octopart.com/CL21B104KBCNNNC-Samsung-Electro-Mechanics-datasheet-8324245.pdf; ComponentLink2Description: https://datasheet.octopart.com/CL21B104KBCNNNC-Samsung-Electro-Mechanics-datasheet-8324245.pdf; ComponentLink3URL: https://datasheet.octopart.com/CL21B104KBCNNNC-Samsung-Electro-Mechanics-datasheet-97040617.pdf; ComponentLink3Description: https://datasheet.octopart.com/CL21B104KBCNNNC-Samsung-Electro-Mechanics-datasheet-97040617.pdf; ComponentLink4URL: https://datasheet.octopart.com:443/CL21B104KBCNNNC-Samsung-Electro-Mechanics-datasheet-11548950.pdf?src-supplier=Future+Electronics; ComponentLink4Description: https://datasheet.octopart.com:443/CL21B104KBCNNNC-Samsung-Electro-Mechanics-datasheet-11548950.pdf?src-supplier=Future+Electronics; ComponentLink5URL: https://datasheet.octopart.com:443/CL21B104KBCNNNC-Samsung-Electro-Mechanics-datasheet-116891032.pdf?src-supplier=Future+Electronics; ComponentLink5Description: https://datasheet.octopart.com:443/CL21B104KBCNNNC-Samsung-Electro-Mechanics-datasheet-116891032.pdf?src-supplier=Future+Electronics; ComponentLink6URL: https://datasheet.octopart.com:443/CL21B104KBCNNNC-Samsung-Electro-Mechanics-datasheet-81462175.pdf?src-supplier=Future+Electronics; ComponentLink6Description: https://datasheet.octopart.com:443/CL21B104KBCNNNC-Samsung-Electro-Mechanics-datasheet-81462175.pdf?src-supplier=Future+Electronics; ComponentLink7URL: https://datasheet.octopart.com:443/CL21B104KBCNNNC-Samsung-datasheet-42485244.pdf?src-supplier=Future+Electronics; ComponentLink7Description: https://datasheet.octopart.com:443/CL21B104KBCNNNC-Samsung-datasheet-42485244.pdf?src-supplier=Future+Electronics; ComponentLink8URL: https://datasheet.octopart.com:443/CL21B104KBCNNNC-Samsung-Electro-Mechanics-datasheet-149045937.pdf?src-supplier=Future+Electronics; ComponentLink8Description: https://datasheet.octopart.com:443/CL21B104KBCNNNC-Samsung-Electro-Mechanics-datasheet-149045937.pdf?src-supplier=Future+Electronics; ComponentLink9URL: https://datasheet.octopart.com:443/CL21B104KBCNNNC-Samsung-datasheet-8326407.pdf?src-supplier=TME; ComponentLink9Description: https://datasheet.octopart.com:443/CL21B104KBCNNNC-Samsung-datasheet-8326407.pdf?src-supplier=TME
D15 = AQ3045-01ETG: TVS DIODE 5.3VWM 12VC SOD882; Manufacturer: Littelfuse; Diode Element Material: SILICON; Package Body Material: Plastic; Polarity: Bidirectional; Max Breakdown Voltage: 9V; Min Breakdown Voltage: 6.8V; Diode Type: TRANS VOLTAGE SUPPRESSOR; Non-rep Peak Rev Power Dis-Max: 40W; Number of Elements: 1; Rep Pk Reverse Voltage-Max: 5.3V; Reference Standard: AEC-Q101; Supplier: Digikey; Supplier Part Number: F9321CT-ND; Manufacturer Part Number: AQ3045-01ETG; RoHS: Yes; Category: TVS Diodes; Stock: 21664; Pricing: 1=0.5, 10=0.391, 100=0.2344, 500=0.217, 1000=0.14756, 2000=0.13585, 5000=0.1302 (USD); Pins: 2; Package Shape: Rectangular; Min Operating Temperature: -55°C; Max Operating Temperature: 150°C; Package Style: CHIP CARRIERMeter; Surface Mount: Yes; Technology: AVALANCHE; Terminal Form: No Lead; Terminal Position: BOTTOM; Reach SVHC Compliant: Yes; RoHS Compliant: Yes; ComponentLink1URL: https://datasheet.ciiva.com:443/pdfs/VipMasterIC/IC/LFSI/LFSI-S-A0007892042/LFSI-S-A0007892042-1.pdf?src-supplier=IHS+Markit; ComponentLink1Description: https://datasheet.ciiva.com:443/pdfs/VipMasterIC/IC/LFSI/LFSI-S-A0007892042/LFSI-S-A0007892042-1.pdf?src-supplier=IHS+Markit; ComponentLink2URL: https://www.littelfuse.com/~/media/electronics/datasheets/tvs_diode_arrays/littelfuse_tvs_diode_array_aq3045_datasheet.pdf.pdf?src-supplier=Digikey; ComponentLink2Description: https://www.littelfuse.com/~/media/electronics/datasheets/tvs_diode_arrays/littelfuse_tvs_diode_array_aq3045_datasheet.pdf.pdf?src-supplier=Digikey; ComponentLink3URL: http://www.littelfuse.com/~/media/electronics/datasheets/tvs_diode_arrays/littelfuse_tvs_diode_array_aq3045_datasheet.pdf.pdf?src-supplier=Digikey; ComponentLink3Description: http://www.littelfuse.com/~/media/electronics/datasheets/tvs_diode_arrays/littelfuse_tvs_diode_array_aq3045_datasheet.pdf.pdf?src-supplier=Digikey; LCSC Part Number: C3710326
J6 = B5B-XH-A: Board Connector, 5 Contact(s), 1 Row(s), Male, Straight, 0.098 inch Pitch, Solder Terminal; Manufacturer: JST; Contact Resistance: 20mΩ; Current Rating: 3A; Insulation Resistance: 1GΩ; Supplier: DigiKey; Supplier Part Number: 455-B5B-XH-A-ND; Manufacturer Part Number: B5B-XH-A; RoHS: Compliant; Category: Card Edge Connectors; Stock: 112530; Pricing: 1=0.17, 10=0.144, 100=0.1225, 500=0.10932, 1000=0.10409, 5000=0.0929, 10000=0.08847 (USD); Contact Gender: Male; Contact Material: Bronze, Tin; Export Control Classification Number (ECCN) Code: EAR99; Housing Material: Nylon; Harmonized Tariff Schedule (HTS) Code: 8536.69.40.40; Introduction Date: 1997-11-01; Lifecycle Status: Production; Max Operating Temperature: 85°C; Min Operating Temperature: -25°C; Pins: 5; Number of Rows: 1; Orientation: Straight; Terminal Pitch: 2.5mm; ComponentLink1URL: https://datasheet.octopart.com:443/B5B-XH-A-JST-datasheet-157850277.pdf?src-supplier=IHS; ComponentLink1Description: https://datasheet.octopart.com:443/B5B-XH-A-JST-datasheet-157850277.pdf?src-supplier=IHS; ComponentLink2URL: https://datasheet.octopart.com:443/B5B-XH-A-JST-datasheet-10026044.pdf?src-supplier=TME; ComponentLink2Description: https://datasheet.octopart.com:443/B5B-XH-A-JST-datasheet-10026044.pdf?src-supplier=TME
R19 R20 = RC0805JR-070RL: GENERAL PURPOSE CHIP RESISTOR Metal Glaze/thick Film, 0.125W, 0ohm, Surface Mount, 0805; Manufacturer: Yageo Group; Power Dissipation: 125mW; Value: 0Ω; Temperature Coefficient: 300ppm/°C; Tolerance: 5%; Voltage Rating: 150V; Supplier: DigiKey; Supplier Part Number: 311-0.0ARDKR-ND; Manufacturer Part Number: RC0805JR-070RL; RoHS: Compliant; Category: Chip SMD Resistors; Stock: 1260777; Pricing: 1=0.1, 10=0.015, 25=0.0128, 50=0.011, 100=0.0097, 250=0.00812, 500=0.00716, 1000=0.00633 (USD); Case/Package: 0805; Case Code (Imperial): 0805; China RoHS: Non-Compliant; Composition: Thick Film; Contact Plating: Tin; Depth: 1.25mm; Height: 500µm; Lead Free: Lead Free; Length: 2mm; Lifecycle Status: Production; Max Operating Temperature: 155°C; Military Standard: Not; Min Operating Temperature: -55°C; Mounting Technology: Surface Mount; Pins: 2; Number of Terminals: 2; Packaging: Tape & Reel; Power Rating: 125mW; Radiation Hardening: No; REACH SVHC: Yes; Schedule B: 8533290000, 8533290000|8533290000, 8533290000|8533290000|8533290000, 8533290000|8533290000|8533290000|8533290000; Termination: SMD/SMT; Voltage Rating (DC): 150V; Width: 1.25mm; ComponentLink1URL: https://datasheet.octopart.com:443/RC0805JR-070RL-Yageo-datasheet-182189538.pdf?src-supplier=IHS; ComponentLink1Description: https://datasheet.octopart.com:443/RC0805JR-070RL-Yageo-datasheet-182189538.pdf?src-supplier=IHS; ComponentLink2URL: https://datasheet.octopart.com:443/RC0805JR-070RL-Yageo-datasheet-103092701.pdf?src-supplier=Upverter; ComponentLink2Description: https://datasheet.octopart.com:443/RC0805JR-070RL-Yageo-datasheet-103092701.pdf?src-supplier=Upverter; ComponentLink3URL: https://datasheet.octopart.com:443/RC0805JR-070RL-Yageo-datasheet-98239111.pdf?src-supplier=Upverter; ComponentLink3Description: https://datasheet.octopart.com:443/RC0805JR-070RL-Yageo-datasheet-98239111.pdf?src-supplier=Upverter; ComponentLink4URL: https://datasheet.octopart.com:443/RC0805JR-070RL-Yageo-datasheet-8330313.pdf?src-supplier=Newark; ComponentLink4Description: https://datasheet.octopart.com:443/RC0805JR-070RL-Yageo-datasheet-8330313.pdf?src-supplier=Newark; ComponentLink5URL: https://datasheet.octopart.com:443/RC0805JR-070RL-Yageo-datasheet-8327506.pdf?src-supplier=Newark; ComponentLink5Description: https://datasheet.octopart.com:443/RC0805JR-070RL-Yageo-datasheet-8327506.pdf?src-supplier=Newark; ComponentLink6URL: https://datasheet.octopart.com:443/RC0805JR-070RL-Yageo-datasheet-62067350.pdf?src-supplier=element14+APAC; ComponentLink6Description: https://datasheet.octopart.com:443/RC0805JR-070RL-Yageo-datasheet-62067350.pdf?src-supplier=element14+APAC; ComponentLink7URL: https://datasheet.octopart.com:443/RC0805JR-070RL-Yageo-datasheet-17879891.pdf?src-supplier=element14+APAC; ComponentLink7Description: https://datasheet.octopart.com:443/RC0805JR-070RL-Yageo-datasheet-17879891.pdf?src-supplier=element14+APAC; ComponentLink8URL: https://datasheet.octopart.com:443/RC0805JR-070RL-Yageo-Group-datasheet-176638170.pdf?src-supplier=Future+Electronics; ComponentLink8Description: https://datasheet.octopart.com:443/RC0805JR-070RL-Yageo-Group-datasheet-176638170.pdf?src-supplier=Future+Electronics; ComponentLink9URL: https://datasheet.octopart.com:443/RC0805JR-070RL-Yageo-datasheet-164759695.pdf?src-supplier=Future+Electronics; ComponentLink9Description: https://datasheet.octopart.com:443/RC0805JR-070RL-Yageo-datasheet-164759695.pdf?src-supplier=Future+Electronics; ComponentLink10URL: https://datasheet.octopart.com:443/RC0805JR-070RL-Yageo-datasheet-15800360.pdf?src-supplier=Future+Electronics; ComponentLink10Description: https://datasheet.octopart.com:443/RC0805JR-070RL-Yageo-datasheet-15800360.pdf?src-supplier=Future+Electronics; ComponentLink11URL: https://datasheet.octopart.com:443/RC0805JR-070RL-Yageo-datasheet-12592811.pdf?src-supplier=Future+Electronics; ComponentLink11Description: https://datasheet.octopart.com:443/RC0805JR-070RL-Yageo-datasheet-12592811.pdf?src-supplier=Future+Electronics; ComponentLink12URL: https://datasheet.octopart.com:443/RC0805JR-070RL-Yageo-datasheet-8324252.pdf?src-supplier=Future+Electronics; ComponentLink12Description: https://datasheet.octopart.com:443/RC0805JR-070RL-Yageo-datasheet-8324252.pdf?src-supplier=Future+Electronics; ComponentLink13URL: https://datasheet.octopart.com:443/RC0805JR-070RL-Yageo-datasheet-79472498.pdf?src-supplier=Megastar; ComponentLink13Description: https://datasheet.octopart.com:443/RC0805JR-070RL-Yageo-datasheet-79472498.pdf?src-supplier=Megastar; ComponentLink14URL: https://datasheet.octopart.com/RC0805JR-070RL-Yageo-datasheet-73766026.pdf; ComponentLink14Description: https://datasheet.octopart.com/RC0805JR-070RL-Yageo-datasheet-73766026.pdf; ComponentLink15URL: https://datasheet.octopart.com:443/RC0805JR-070RL-Yageo-datasheet-8377918.pdf?src-supplier=Farnell; ComponentLink15Description: https://datasheet.octopart.com:443/RC0805JR-070RL-Yageo-datasheet-8377918.pdf?src-supplier=Farnell; ComponentLink16URL: https://datasheet.octopart.com:443/RC0805JR-070RL-Yageo-datasheet-118657.pdf?src-supplier=DigiKey; ComponentLink16Description: https://datasheet.octopart.com:443/RC0805JR-070RL-Yageo-datasheet-118657.pdf?src-supplier=DigiKey; ComponentLink17URL: http://sigma.octopart.com:80/conflict_mineral_statement/Yageo-company-3.pdf?src-supplier=Compliance+Statements; ComponentLink17Description: http://sigma.octopart.com:80/conflict_mineral_statement/Yageo-company-3.pdf?src-supplier=Compliance+Statements; ComponentLink18URL: http://sigma.octopart.com:80/rohs_statement/Yageo-company-2.pdf?src-supplier=Compliance+Statements; ComponentLink18Description: http://sigma.octopart.com:80/rohs_statement/Yageo-company-2.pdf?src-supplier=Compliance+Statements
U7 = USBLC6-2SC6: as U3 on sheet USB-C_to_ESP; Supplier: DigiKey; Supplier Part Number: 497-5235-1-ND; Manufacturer Part Number: USBLC6-2SC6; RoHS: Compliant; Category: TVS Diodes; Stock: 229189; Pricing: 1=0.36, 10=0.243, 100=0.163, 500=0.127, 1000=0.114, 3000=0.077, 6000=0.076, 9000=0.075 (USD); Case/Package: SOT-23; China RoHS: Compliant; Clamping Voltage: 17V; Contact Plating: Tin; Country of Origin: Mainland China; Depth: 1.75mm; Export Control Classification Number (ECCN) Code: EAR99; Height: 1.45mm; Harmonized Tariff Schedule (HTS) Code: 8541.10.00.50; Introduction Date: 2005-03-15; Lead Free: Lead Free; Length: 3.05mm; Lifecycle Status: Production; Max Breakdown Voltage: 6V; Max Operating Temperature: 125°C; Max Reverse Leakage Current: 150nA; Min Breakdown Voltage: 6V; Min Operating Temperature: -40°C; Mounting Technology: Surface Mount; Number of Channels: 2; Pins: 6; Number of Terminals: 6; Operating Supply Voltage: 1.1V; Peak Pulse Current: 5A; Peak Reverse Current: 150nA; Polarity: Unidirectional; Power Line Protection: Yes; Radiation Hardening: No; REACH SVHC: Yes; Reverse Breakdown Voltage: 6V; Schedule B: 8536300000, 8536300000|8536300000|8536300000|8536300000|8536300000|8536300000|8536300000|8536300000|8536300000|8536300000|8536300000|8536300000|8536300000|8536300000|8536300000|8536300000|8536300000|8536300000|8536300000|8536300000|8536300000|8536300000|8536300000|85; Termination: SMD/SMT; Width: 1.75mm; Working Voltage: 5V; ComponentLink1URL: https://datasheet.octopart.com:443/USBLC6-2SC6-STMicroelectronics-datasheet-10412581.pdf?src-supplier=Newark; ComponentLink1Description: https://datasheet.octopart.com:443/USBLC6-2SC6-STMicroelectronics-datasheet-10412581.pdf?src-supplier=Newark; ComponentLink2URL: https://datasheet.octopart.com:443/USBLC6-2SC6-STMicroelectronics-datasheet-181961833.pdf?src-supplier=Newark; ComponentLink2Description: https://datasheet.octopart.com:443/USBLC6-2SC6-STMicroelectronics-datasheet-181961833.pdf?src-supplier=Newark; ComponentLink3URL: https://datasheet.octopart.com:443/USBLC6-2SC6-STMicroelectronics-datasheet-525477.pdf?src-supplier=Factory+Futures; ComponentLink3Description: https://datasheet.octopart.com:443/USBLC6-2SC6-STMicroelectronics-datasheet-525477.pdf?src-supplier=Factory+Futures; ComponentLink4URL: https://datasheet.octopart.com:443/USBLC6-2SC6-STMicroelectronics-datasheet-82998616.pdf?src-supplier=Farnell; ComponentLink4Description: https://datasheet.octopart.com:443/USBLC6-2SC6-STMicroelectronics-datasheet-82998616.pdf?src-supplier=Farnell; ComponentLink5URL: https://datasheet.octopart.com:443/USBLC6-2SC6-STMicroelectronics-datasheet-46285.pdf?src-supplier=Farnell; ComponentLink5Description: https://datasheet.octopart.com:443/USBLC6-2SC6-STMicroelectronics-datasheet-46285.pdf?src-supplier=Farnell; ComponentLink6URL: https://datasheet.octopart.com:443/USBLC6-2SC6-STMicroelectronics-datasheet-14050643.pdf?src-supplier=iiiC; ComponentLink6Description: https://datasheet.octopart.com:443/USBLC6-2SC6-STMicroelectronics-datasheet-14050643.pdf?src-supplier=iiiC; ComponentLink7URL: https://datasheet.octopart.com:443/USBLC6-2SC6-STMicroelectronics-datasheet-10521292.pdf?src-supplier=Jameco; ComponentLink7Description: https://datasheet.octopart.com:443/USBLC6-2SC6-STMicroelectronics-datasheet-10521292.pdf?src-supplier=Jameco